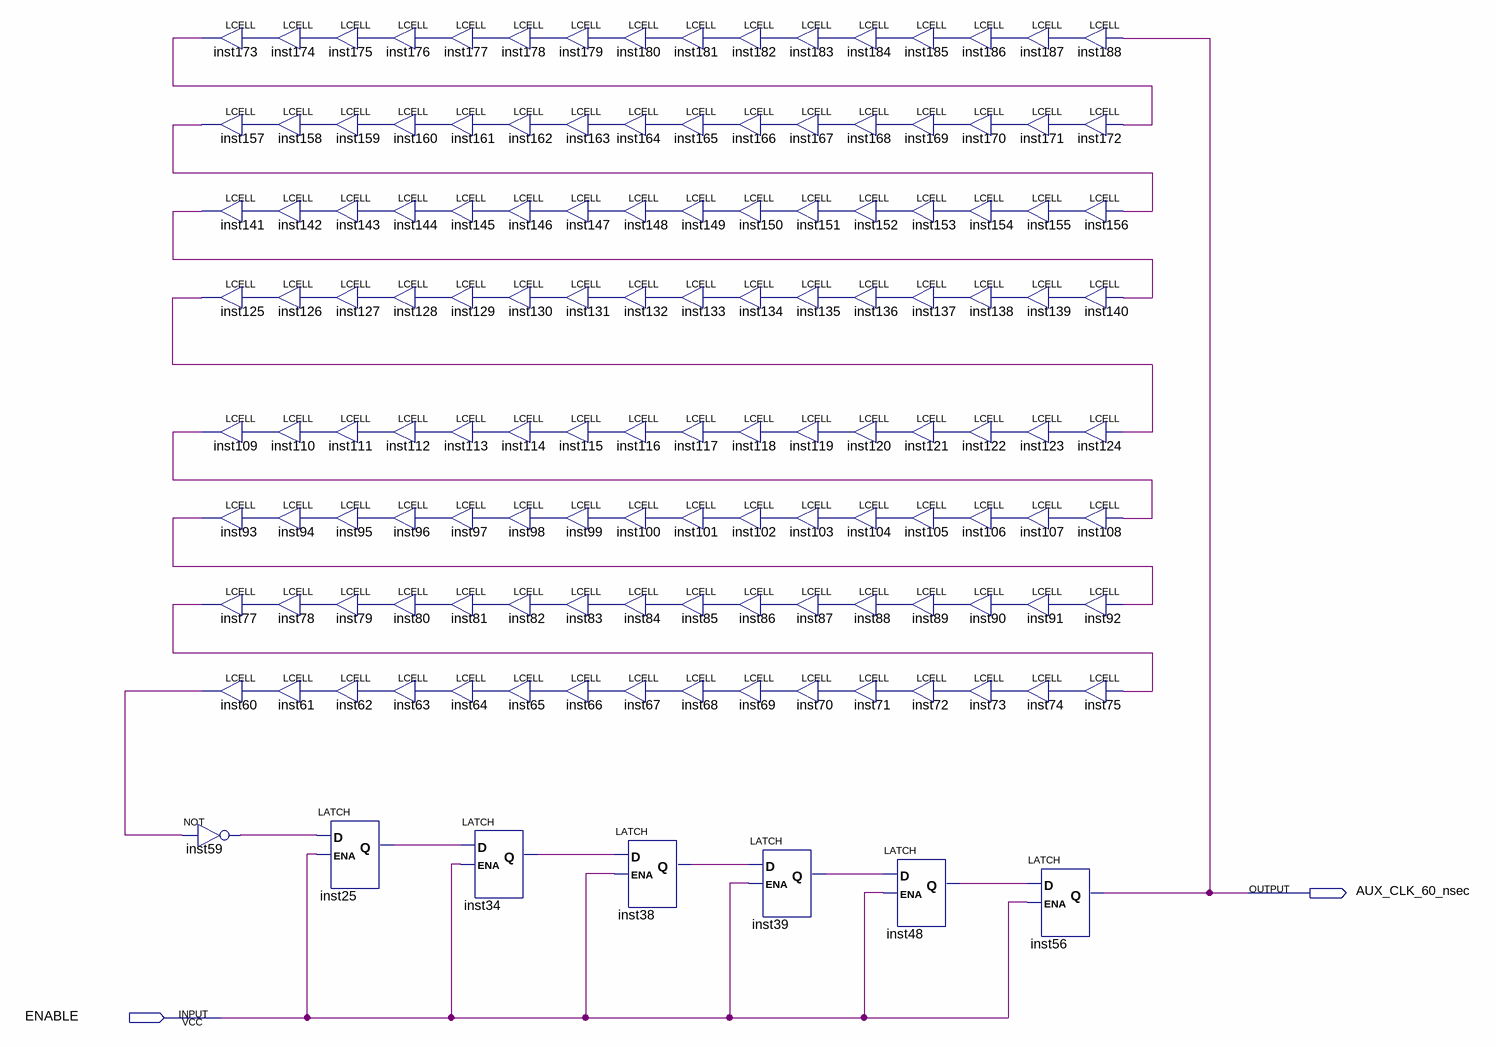
[diagram p0: schematic sheet]
// Quartus schematic AUTOCLOCK.bdf as structural Verilog: 135 symbols, 2 pins
module AUTOCLOCK (
  input  ENABLE,
  output AUX_CLK_60_nsec
);

  wire inst25_q, inst34_q, inst38_q, inst39_q, inst48_q, inst59_out, inst60_out, inst61_out, inst62_out,
       inst63_out, inst64_out, inst65_out, inst66_out, inst67_out, inst68_out, inst69_out, inst70_out,
       inst71_out, inst72_out, inst73_out, inst74_out, inst75_out, inst77_out, inst78_out, inst79_out,
       inst80_out, inst81_out, inst82_out, inst83_out, inst84_out, inst85_out, inst86_out, inst87_out,
       inst88_out, inst89_out, inst90_out, inst91_out, inst92_out, inst93_out, inst94_out, inst95_out,
       inst96_out, inst97_out, inst98_out, inst99_out, inst100_out, inst101_out, inst102_out, inst103_out,
       inst104_out, inst105_out, inst106_out, inst107_out, inst108_out, inst109_out, inst110_out,
       inst111_out, inst112_out, inst113_out, inst114_out, inst115_out, inst116_out, inst117_out,
       inst118_out, inst119_out, inst120_out, inst121_out, inst122_out, inst123_out, inst124_out,
       inst125_out, inst126_out, inst127_out, inst128_out, inst129_out, inst130_out, inst131_out,
       inst132_out, inst133_out, inst134_out, inst135_out, inst136_out, inst137_out, inst138_out,
       inst139_out, inst140_out, inst141_out, inst142_out, inst143_out, inst144_out, inst145_out,
       inst146_out, inst147_out, inst148_out, inst149_out, inst150_out, inst151_out, inst152_out,
       inst153_out, inst154_out, inst155_out, inst156_out, inst157_out, inst158_out, inst159_out,
       inst160_out, inst161_out, inst162_out, inst163_out, inst164_out, inst165_out, inst166_out,
       inst167_out, inst168_out, inst169_out, inst170_out, inst171_out, inst172_out, inst173_out,
       inst174_out, inst175_out, inst176_out, inst177_out, inst178_out, inst179_out, inst180_out,
       inst181_out, inst182_out, inst183_out, inst184_out, inst185_out, inst186_out, inst187_out, inst188_out;

  LCELL inst173 (.IN(inst174_out), .OUT(inst173_out));
  LCELL inst157 (.IN(inst158_out), .OUT(inst157_out));
  LCELL inst141 (.IN(inst142_out), .OUT(inst141_out));
  LCELL inst125 (.IN(inst126_out), .OUT(inst125_out));
  LCELL inst109 (.IN(inst110_out), .OUT(inst109_out));
  LCELL inst93 (.IN(inst94_out), .OUT(inst93_out));
  LCELL inst77 (.IN(inst78_out), .OUT(inst77_out));
  LCELL inst60 (.IN(inst61_out), .OUT(inst60_out));
  not inst59 (inst59_out, inst60_out);
  LCELL inst174 (.IN(inst175_out), .OUT(inst174_out));
  LCELL inst158 (.IN(inst159_out), .OUT(inst158_out));
  LCELL inst142 (.IN(inst143_out), .OUT(inst142_out));
  LCELL inst126 (.IN(inst127_out), .OUT(inst126_out));
  LCELL inst110 (.IN(inst111_out), .OUT(inst110_out));
  LCELL inst94 (.IN(inst95_out), .OUT(inst94_out));
  LCELL inst78 (.IN(inst79_out), .OUT(inst78_out));
  LCELL inst61 (.IN(inst62_out), .OUT(inst61_out));
  LCELL inst175 (.IN(inst176_out), .OUT(inst175_out));
  LCELL inst176 (.IN(inst177_out), .OUT(inst176_out));
  LCELL inst159 (.IN(inst160_out), .OUT(inst159_out));
  LCELL inst160 (.IN(inst161_out), .OUT(inst160_out));
  LCELL inst143 (.IN(inst144_out), .OUT(inst143_out));
  LCELL inst144 (.IN(inst145_out), .OUT(inst144_out));
  LCELL inst127 (.IN(inst128_out), .OUT(inst127_out));
  LCELL inst128 (.IN(inst129_out), .OUT(inst128_out));
  LCELL inst111 (.IN(inst112_out), .OUT(inst111_out));
  LCELL inst112 (.IN(inst113_out), .OUT(inst112_out));
  LCELL inst95 (.IN(inst96_out), .OUT(inst95_out));
  LCELL inst96 (.IN(inst97_out), .OUT(inst96_out));
  LCELL inst79 (.IN(inst80_out), .OUT(inst79_out));
  LCELL inst80 (.IN(inst81_out), .OUT(inst80_out));
  LCELL inst62 (.IN(inst63_out), .OUT(inst62_out));
  LCELL inst63 (.IN(inst64_out), .OUT(inst63_out));
  LATCH inst25 (.D(inst59_out), .ENA(ENABLE), .Q(inst25_q));
  LCELL inst177 (.IN(inst178_out), .OUT(inst177_out));
  LCELL inst161 (.IN(inst162_out), .OUT(inst161_out));
  LCELL inst145 (.IN(inst146_out), .OUT(inst145_out));
  LCELL inst129 (.IN(inst130_out), .OUT(inst129_out));
  LCELL inst113 (.IN(inst114_out), .OUT(inst113_out));
  LCELL inst97 (.IN(inst98_out), .OUT(inst97_out));
  LCELL inst81 (.IN(inst82_out), .OUT(inst81_out));
  LCELL inst64 (.IN(inst65_out), .OUT(inst64_out));
  LCELL inst178 (.IN(inst179_out), .OUT(inst178_out));
  LCELL inst162 (.IN(inst163_out), .OUT(inst162_out));
  LCELL inst146 (.IN(inst147_out), .OUT(inst146_out));
  LCELL inst130 (.IN(inst131_out), .OUT(inst130_out));
  LCELL inst114 (.IN(inst115_out), .OUT(inst114_out));
  LCELL inst98 (.IN(inst99_out), .OUT(inst98_out));
  LCELL inst82 (.IN(inst83_out), .OUT(inst82_out));
  LCELL inst65 (.IN(inst66_out), .OUT(inst65_out));
  LATCH inst34 (.D(inst25_q), .ENA(ENABLE), .Q(inst34_q));
  LCELL inst179 (.IN(inst180_out), .OUT(inst179_out));
  LCELL inst180 (.IN(inst181_out), .OUT(inst180_out));
  LCELL inst163 (.IN(inst164_out), .OUT(inst163_out));
  LCELL inst164 (.IN(inst165_out), .OUT(inst164_out));
  LCELL inst147 (.IN(inst148_out), .OUT(inst147_out));
  LCELL inst148 (.IN(inst149_out), .OUT(inst148_out));
  LCELL inst131 (.IN(inst132_out), .OUT(inst131_out));
  LCELL inst132 (.IN(inst133_out), .OUT(inst132_out));
  LCELL inst115 (.IN(inst116_out), .OUT(inst115_out));
  LCELL inst116 (.IN(inst117_out), .OUT(inst116_out));
  LCELL inst99 (.IN(inst100_out), .OUT(inst99_out));
  LCELL inst100 (.IN(inst101_out), .OUT(inst100_out));
  LCELL inst83 (.IN(inst84_out), .OUT(inst83_out));
  LCELL inst84 (.IN(inst85_out), .OUT(inst84_out));
  LCELL inst66 (.IN(inst67_out), .OUT(inst66_out));
  LCELL inst67 (.IN(inst68_out), .OUT(inst67_out));
  LCELL inst181 (.IN(inst182_out), .OUT(inst181_out));
  LCELL inst165 (.IN(inst166_out), .OUT(inst165_out));
  LCELL inst149 (.IN(inst150_out), .OUT(inst149_out));
  LCELL inst133 (.IN(inst134_out), .OUT(inst133_out));
  LCELL inst117 (.IN(inst118_out), .OUT(inst117_out));
  LCELL inst101 (.IN(inst102_out), .OUT(inst101_out));
  LCELL inst85 (.IN(inst86_out), .OUT(inst85_out));
  LCELL inst68 (.IN(inst69_out), .OUT(inst68_out));
  LATCH inst38 (.D(inst34_q), .ENA(ENABLE), .Q(inst38_q));
  LCELL inst182 (.IN(inst183_out), .OUT(inst182_out));
  LCELL inst166 (.IN(inst167_out), .OUT(inst166_out));
  LCELL inst150 (.IN(inst151_out), .OUT(inst150_out));
  LCELL inst134 (.IN(inst135_out), .OUT(inst134_out));
  LCELL inst118 (.IN(inst119_out), .OUT(inst118_out));
  LCELL inst102 (.IN(inst103_out), .OUT(inst102_out));
  LCELL inst86 (.IN(inst87_out), .OUT(inst86_out));
  LCELL inst69 (.IN(inst70_out), .OUT(inst69_out));
  LATCH inst39 (.D(inst38_q), .ENA(ENABLE), .Q(inst39_q));
  LCELL inst183 (.IN(inst184_out), .OUT(inst183_out));
  LCELL inst184 (.IN(inst185_out), .OUT(inst184_out));
  LCELL inst167 (.IN(inst168_out), .OUT(inst167_out));
  LCELL inst168 (.IN(inst169_out), .OUT(inst168_out));
  LCELL inst151 (.IN(inst152_out), .OUT(inst151_out));
  LCELL inst152 (.IN(inst153_out), .OUT(inst152_out));
  LCELL inst135 (.IN(inst136_out), .OUT(inst135_out));
  LCELL inst136 (.IN(inst137_out), .OUT(inst136_out));
  LCELL inst119 (.IN(inst120_out), .OUT(inst119_out));
  LCELL inst120 (.IN(inst121_out), .OUT(inst120_out));
  LCELL inst103 (.IN(inst104_out), .OUT(inst103_out));
  LCELL inst104 (.IN(inst105_out), .OUT(inst104_out));
  LCELL inst87 (.IN(inst88_out), .OUT(inst87_out));
  LCELL inst88 (.IN(inst89_out), .OUT(inst88_out));
  LCELL inst70 (.IN(inst71_out), .OUT(inst70_out));
  LCELL inst71 (.IN(inst72_out), .OUT(inst71_out));
  LCELL inst185 (.IN(inst186_out), .OUT(inst185_out));
  LCELL inst169 (.IN(inst170_out), .OUT(inst169_out));
  LCELL inst153 (.IN(inst154_out), .OUT(inst153_out));
  LCELL inst137 (.IN(inst138_out), .OUT(inst137_out));
  LCELL inst121 (.IN(inst122_out), .OUT(inst121_out));
  LCELL inst105 (.IN(inst106_out), .OUT(inst105_out));
  LCELL inst89 (.IN(inst90_out), .OUT(inst89_out));
  LCELL inst72 (.IN(inst73_out), .OUT(inst72_out));
  LATCH inst48 (.D(inst39_q), .ENA(ENABLE), .Q(inst48_q));
  LCELL inst186 (.IN(inst187_out), .OUT(inst186_out));
  LCELL inst170 (.IN(inst171_out), .OUT(inst170_out));
  LCELL inst154 (.IN(inst155_out), .OUT(inst154_out));
  LCELL inst138 (.IN(inst139_out), .OUT(inst138_out));
  LCELL inst122 (.IN(inst123_out), .OUT(inst122_out));
  LCELL inst106 (.IN(inst107_out), .OUT(inst106_out));
  LCELL inst90 (.IN(inst91_out), .OUT(inst90_out));
  LCELL inst73 (.IN(inst74_out), .OUT(inst73_out));
  LCELL inst187 (.IN(inst188_out), .OUT(inst187_out));
  LCELL inst188 (.IN(AUX_CLK_60_nsec), .OUT(inst188_out));
  LCELL inst171 (.IN(inst172_out), .OUT(inst171_out));
  LCELL inst172 (.IN(inst173_out), .OUT(inst172_out));
  LCELL inst155 (.IN(inst156_out), .OUT(inst155_out));
  LCELL inst156 (.IN(inst157_out), .OUT(inst156_out));
  LCELL inst139 (.IN(inst140_out), .OUT(inst139_out));
  LCELL inst140 (.IN(inst141_out), .OUT(inst140_out));
  LCELL inst123 (.IN(inst124_out), .OUT(inst123_out));
  LCELL inst124 (.IN(inst125_out), .OUT(inst124_out));
  LCELL inst107 (.IN(inst108_out), .OUT(inst107_out));
  LCELL inst108 (.IN(inst109_out), .OUT(inst108_out));
  LCELL inst91 (.IN(inst92_out), .OUT(inst91_out));
  LCELL inst92 (.IN(inst93_out), .OUT(inst92_out));
  LCELL inst74 (.IN(inst75_out), .OUT(inst74_out));
  LCELL inst75 (.IN(inst77_out), .OUT(inst75_out));
  LATCH inst56 (.D(inst48_q), .ENA(ENABLE), .Q(AUX_CLK_60_nsec));
endmodule
